# Altium schematic sheet 0152_HPB BATTERY CHARGE.SchDoc
size 848 x 558 mm
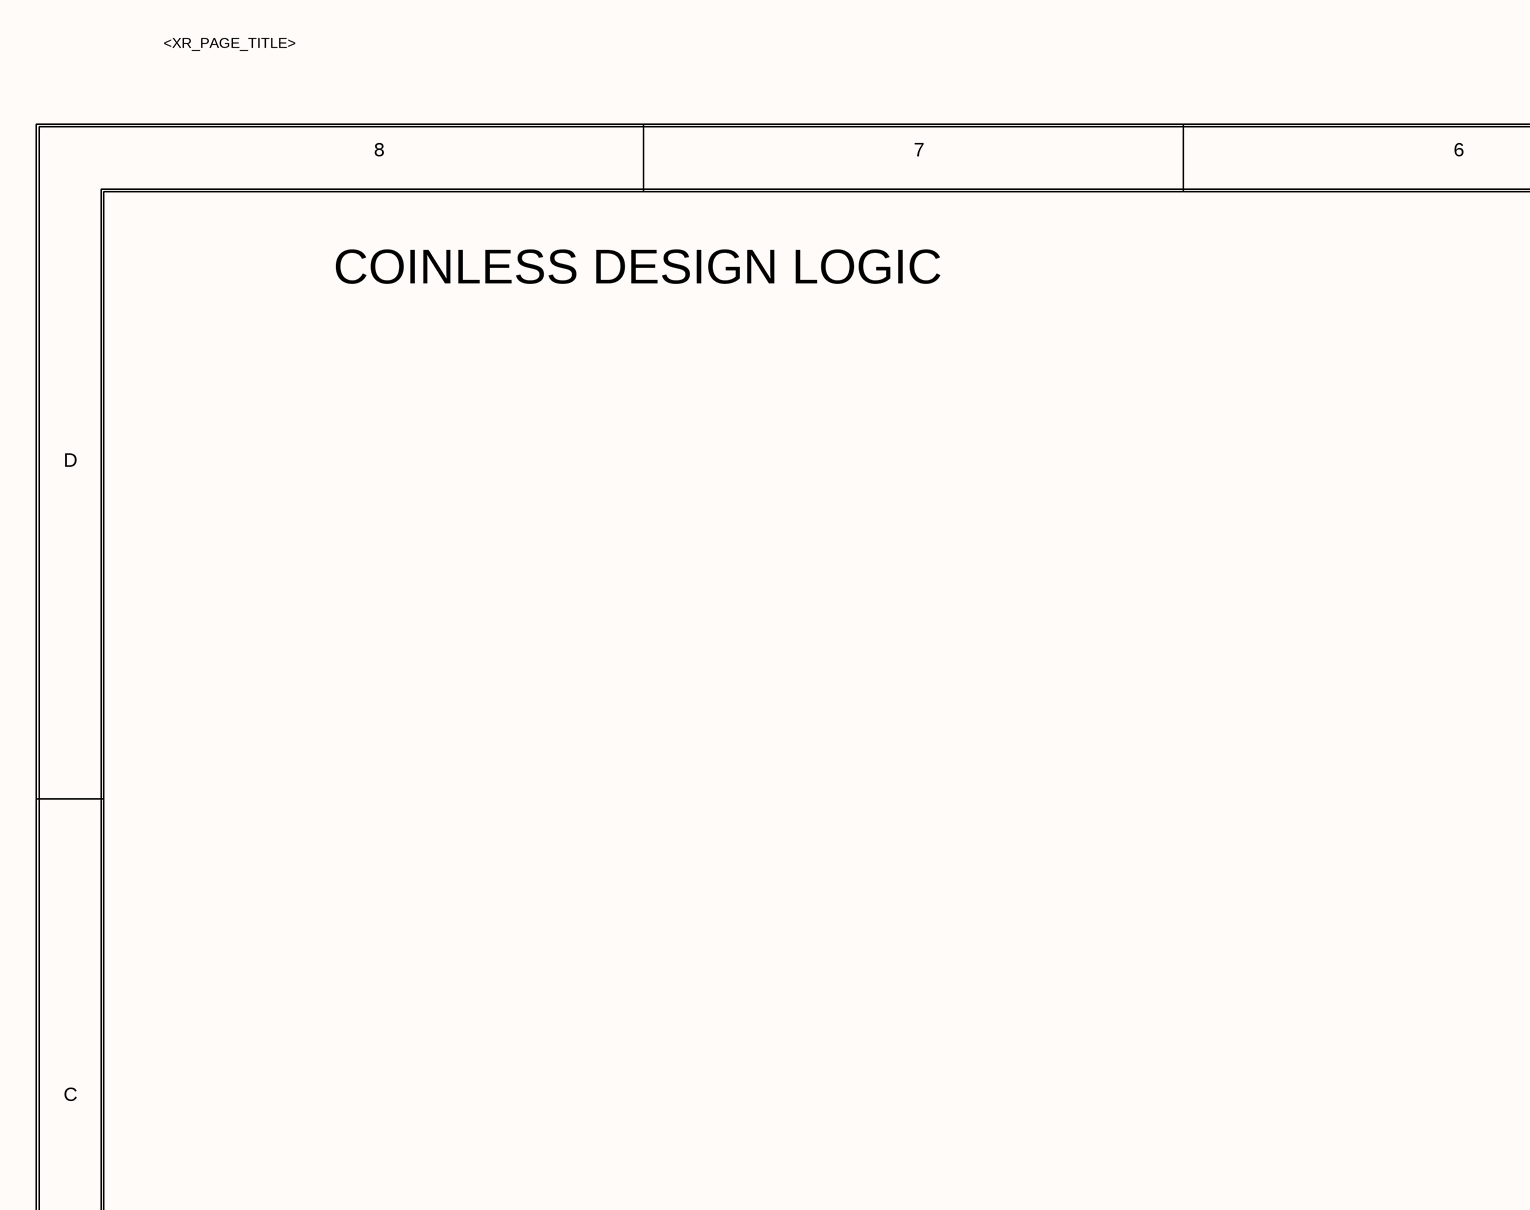
[diagram p0: 0152_HPB BATTERY CHARGE.SchDoc, top left]
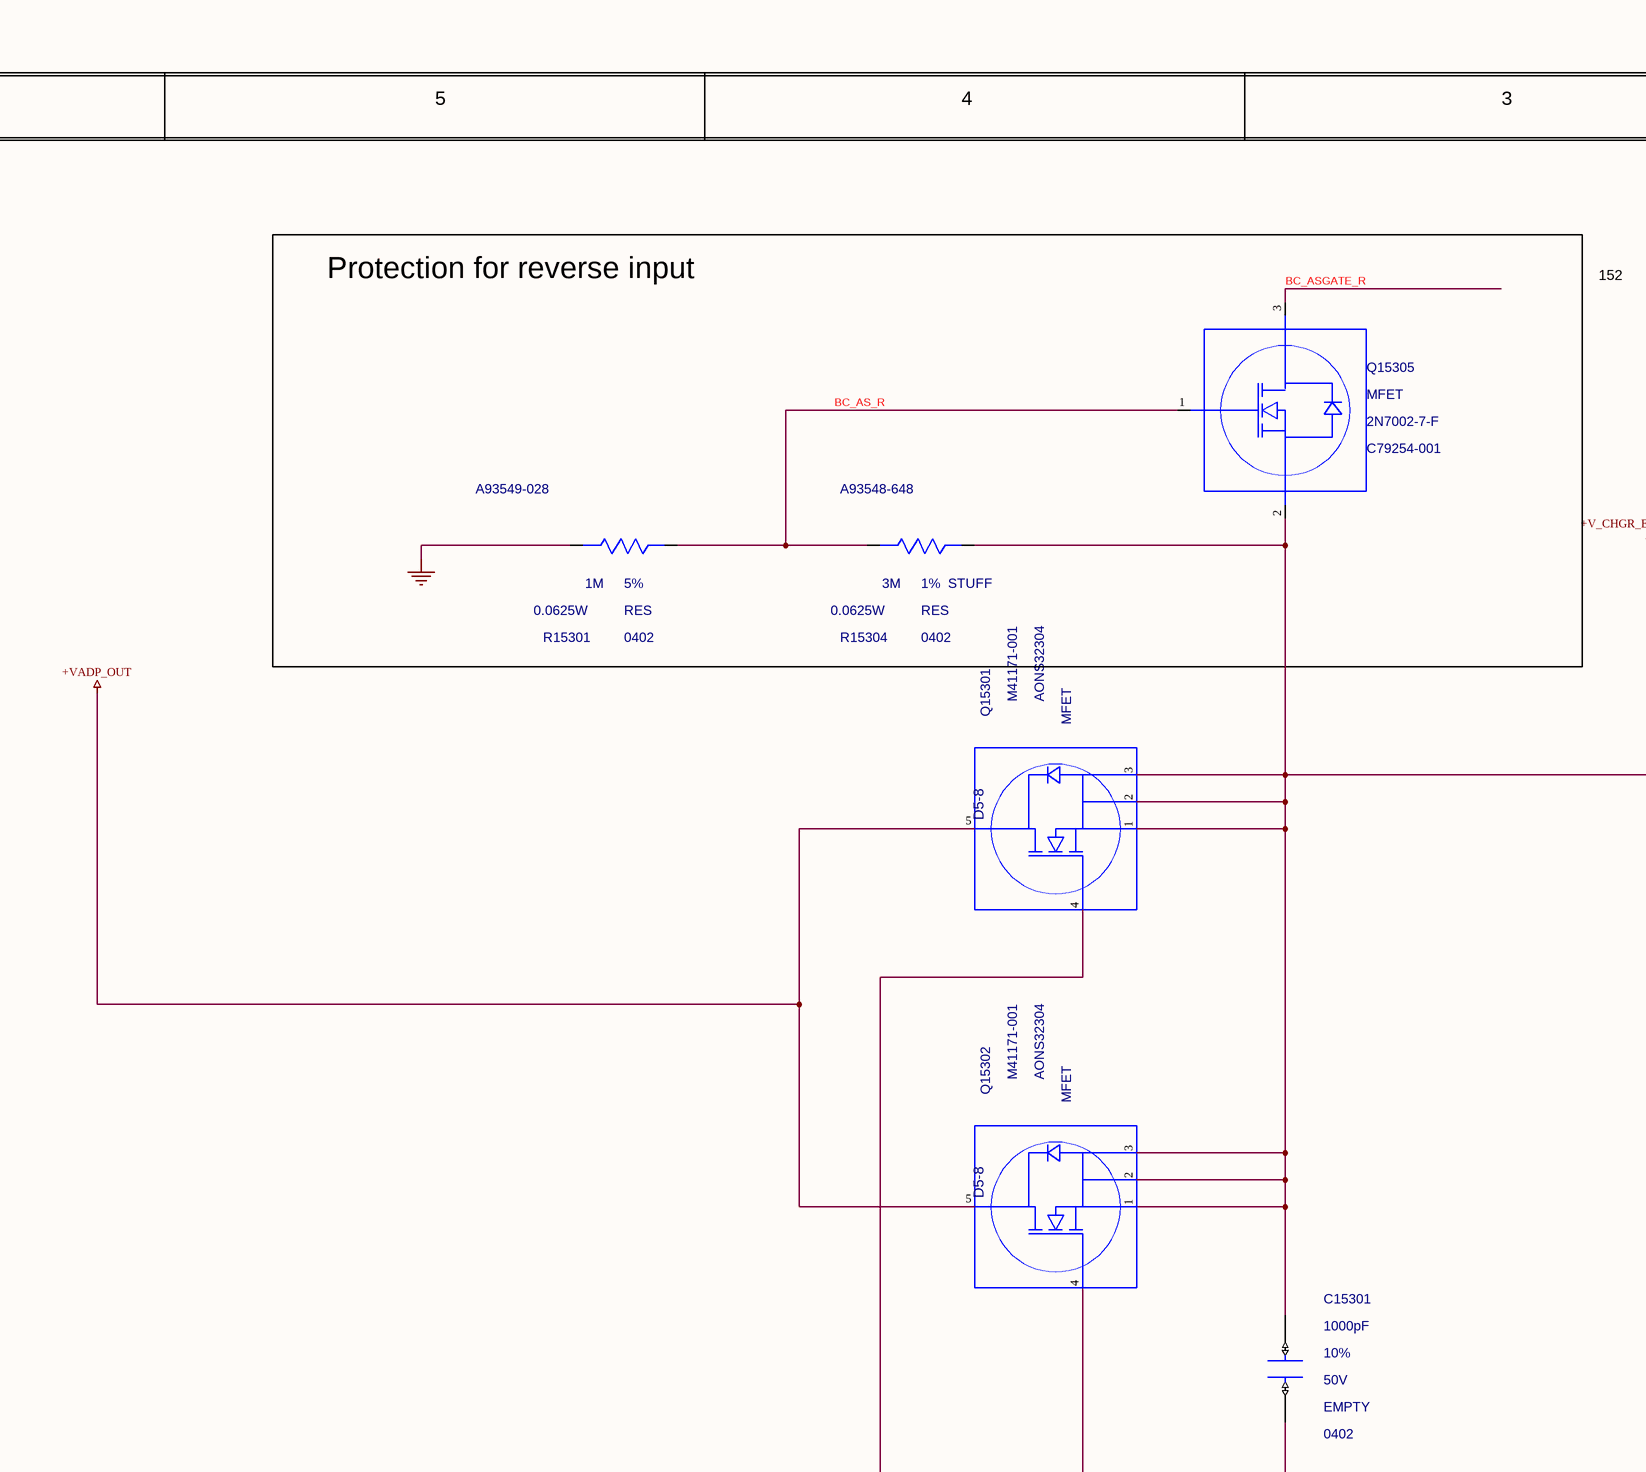
[diagram p1: 0152_HPB BATTERY CHARGE.SchDoc, top middle]
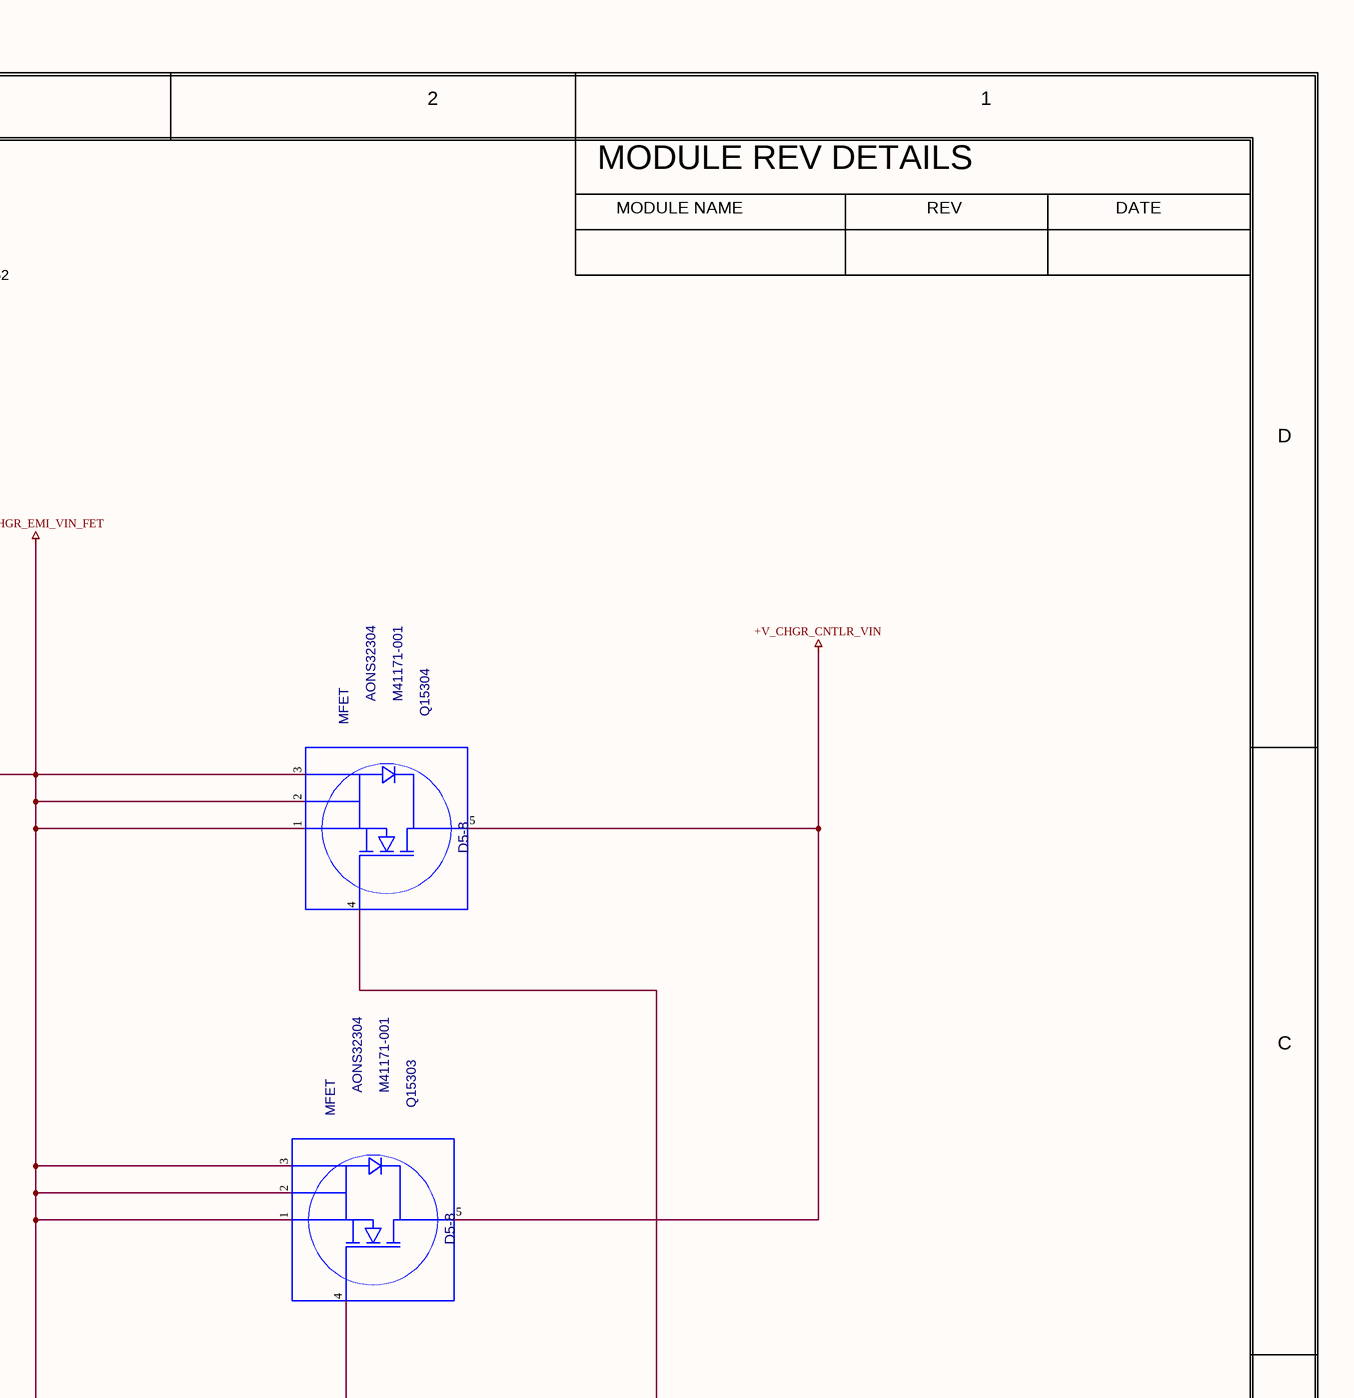
[diagram p2: 0152_HPB BATTERY CHARGE.SchDoc, top right]
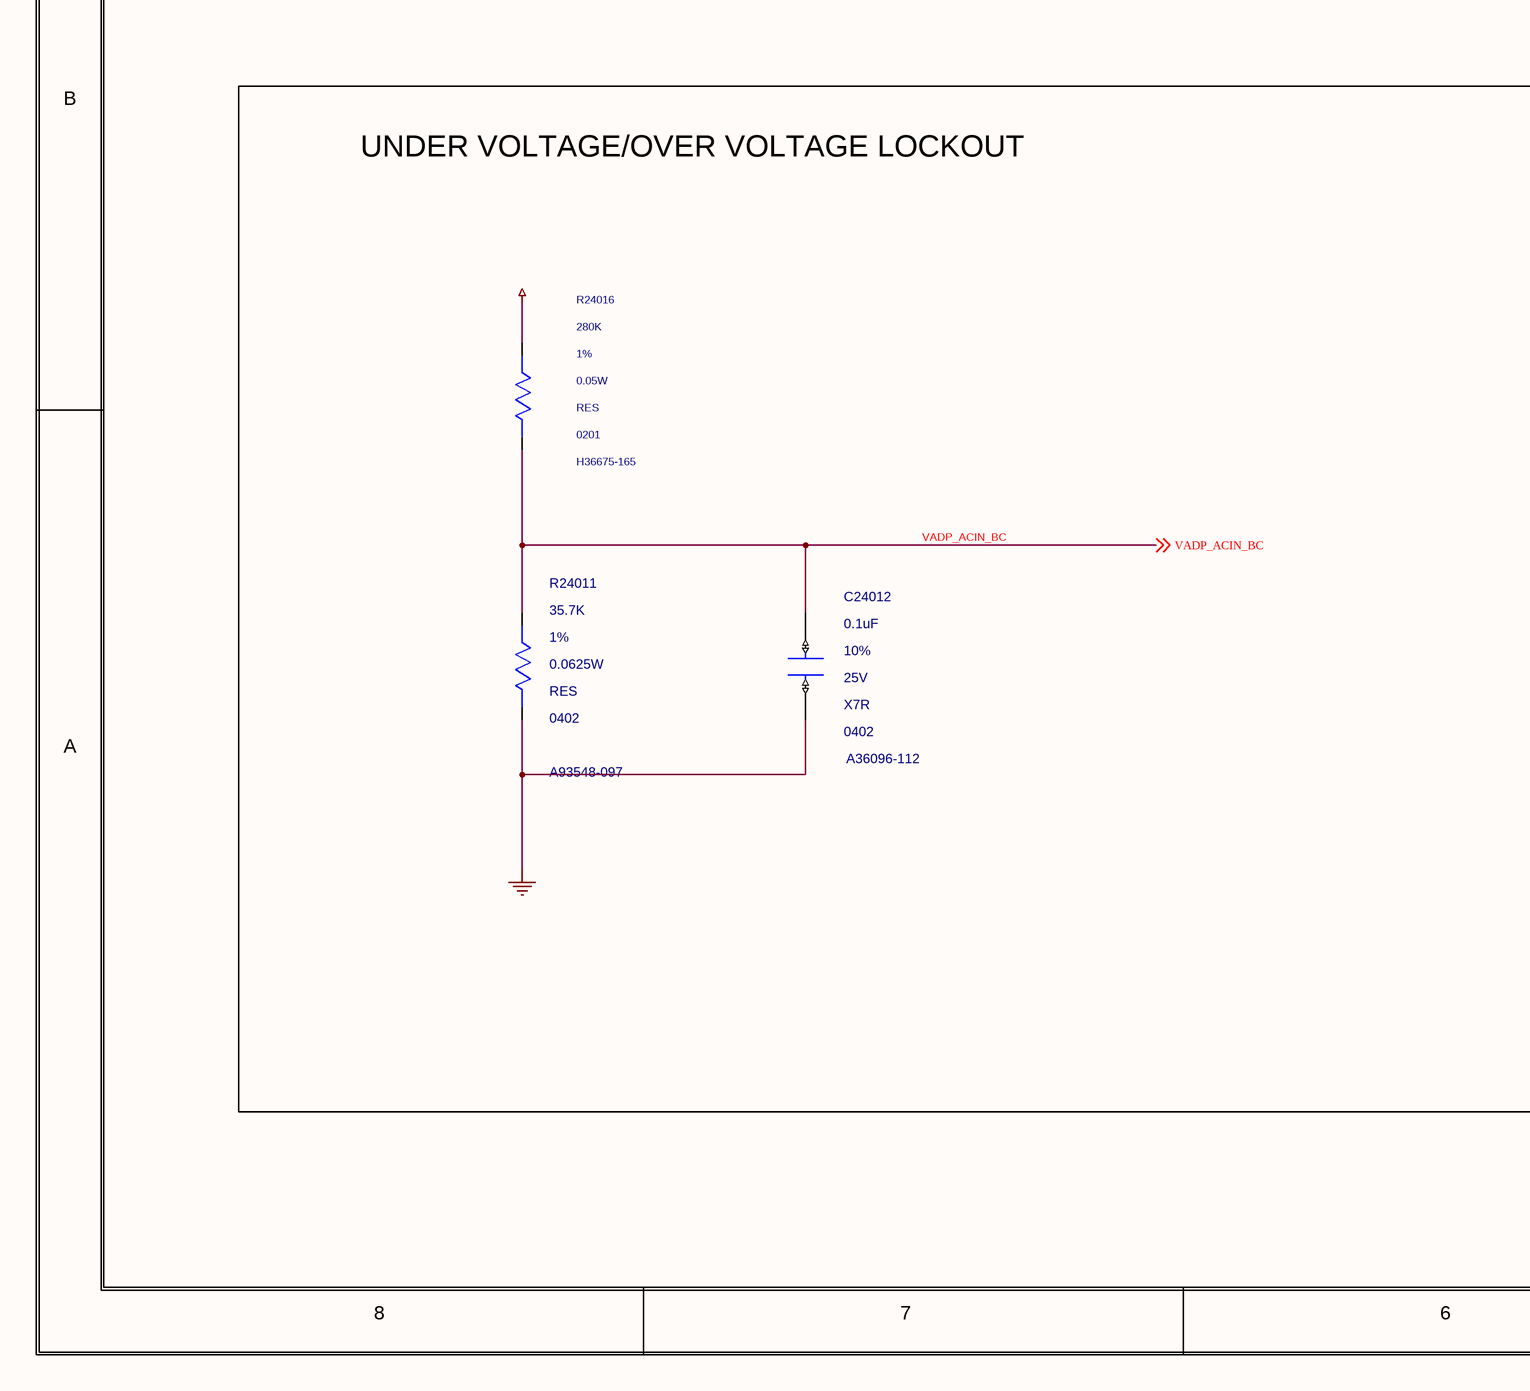
[diagram p3: 0152_HPB BATTERY CHARGE.SchDoc, bottom left]
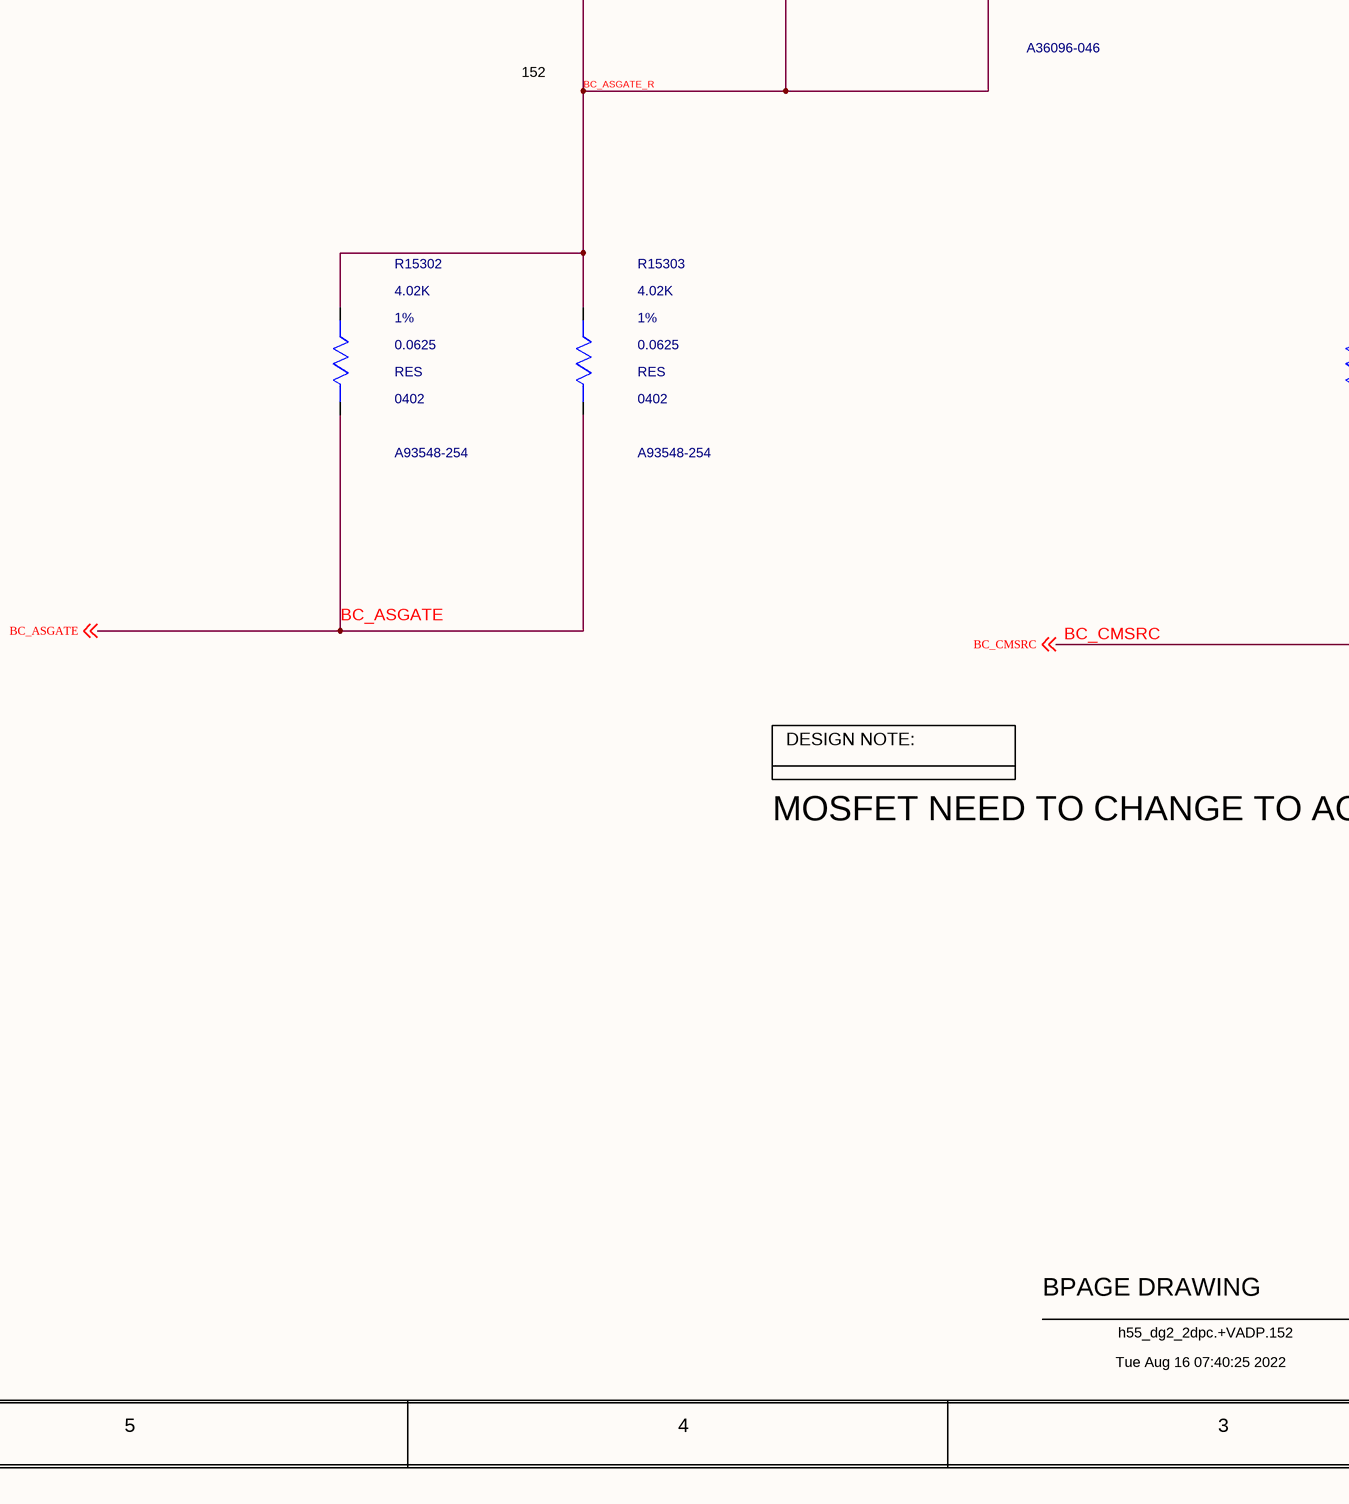
[diagram p4: 0152_HPB BATTERY CHARGE.SchDoc, bottom middle]
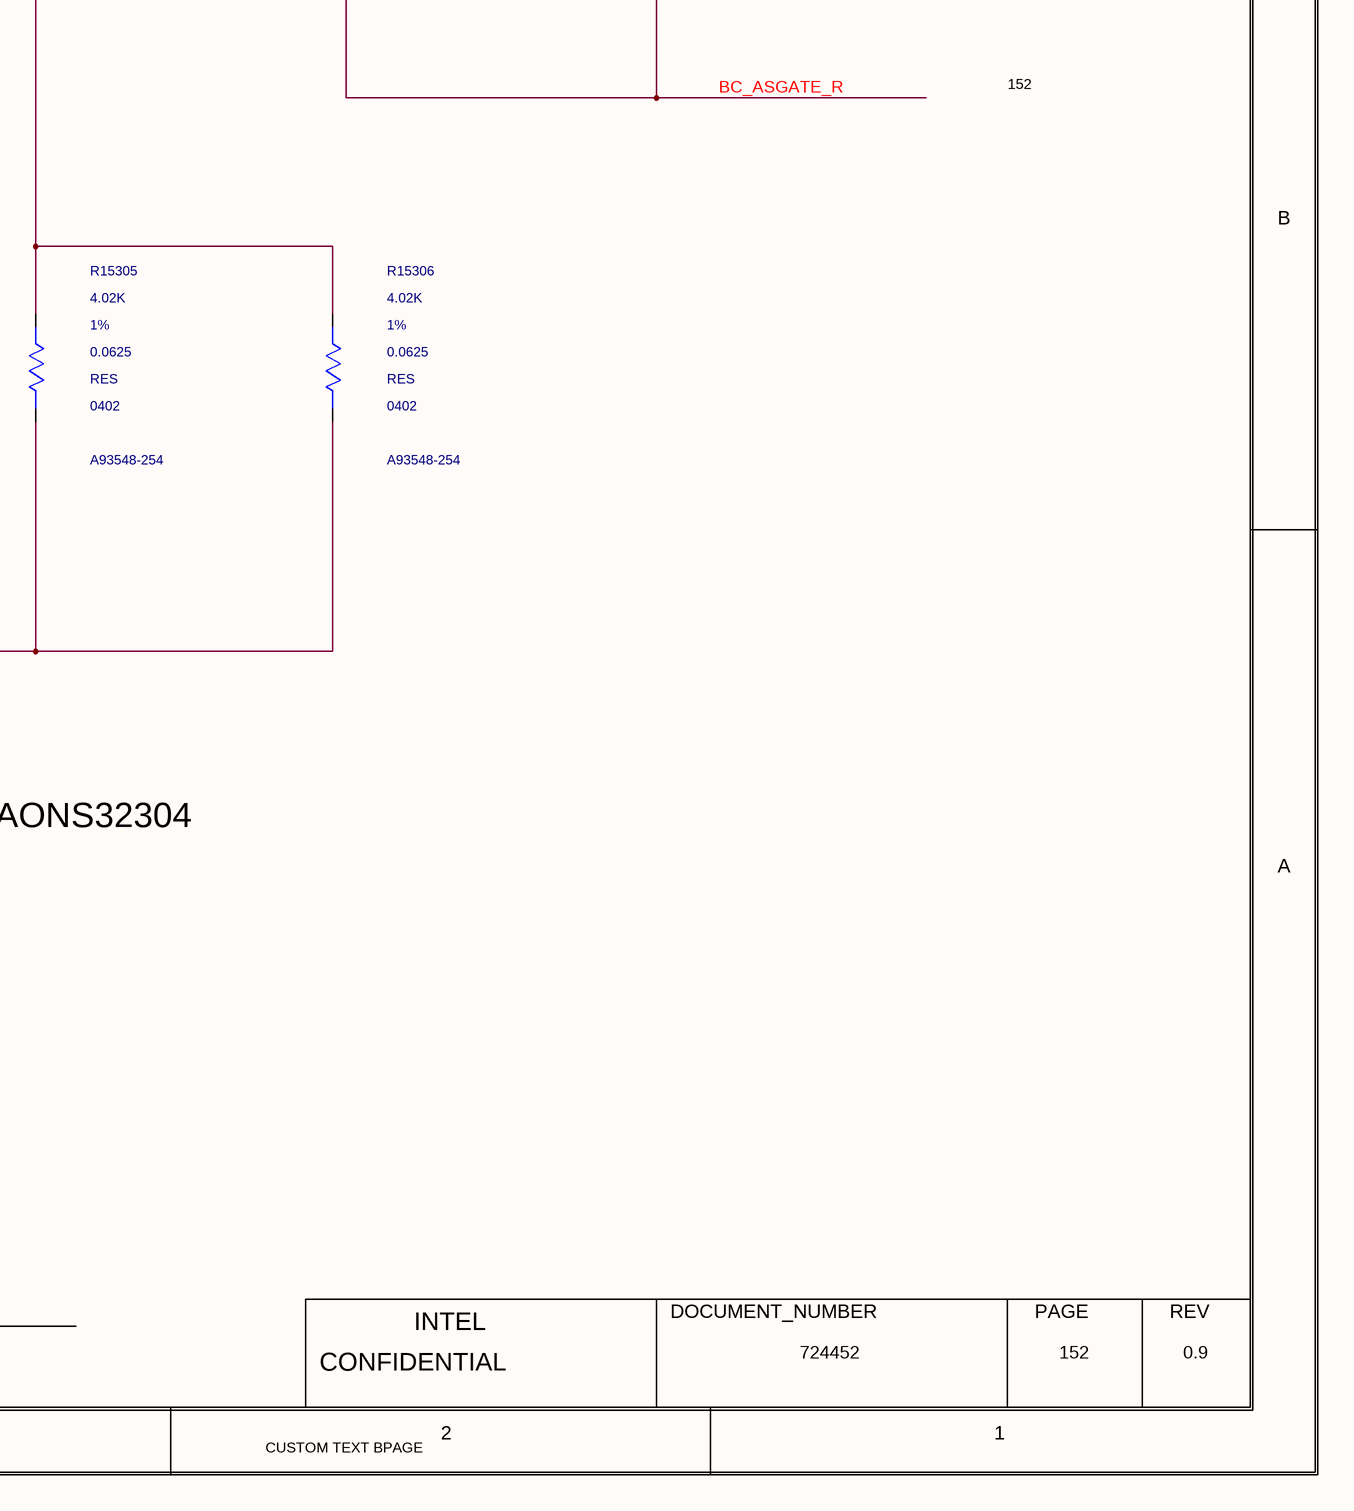
[diagram p5: 0152_HPB BATTERY CHARGE.SchDoc, bottom right]

## Parts
C15301  1000pF  MATERIAL: EMPTY  PACK_TYPE: 0402  PART_NUMBER: A36096-046  TOLERANCE: 10%  VOLTAGE: 50V  [CTK0_SM0402_1100X600_MA]
C24012  0.1uF  MATERIAL: X7R  PACK_TYPE: 0402  PART_NUMBER: A36096-112  TOLERANCE: 10%  VOLTAGE: 25V  [CTK2_SM0402_1050X550_MA]
Q15301  AONS32304  MATERIAL: MFET  PART_NUMBER: M41171-001  [CTK0_LCC8_5650X5300_1270_DF4670X4600_MA_VR]
Q15302  AONS32304  MATERIAL: MFET  PART_NUMBER: M41171-001  [CTK0_LCC8_5650X5300_1270_DF4670X4600_MA_VR]
Q15303  AONS32304  MATERIAL: MFET  PART_NUMBER: M41171-001  [CTK0_LCC8_5650X5300_1270_DF4670X4600_MA_VR]
Q15304  AONS32304  MATERIAL: MFET  PART_NUMBER: M41171-001  [CTK0_LCC8_5650X5300_1270_DF4670X4600_MA_VR]
Q15305  2N7002-7-F  MATERIAL: MFET  PART_NUMBER: C79254-001  [CTK0_SOT23_1400X3040_950_MG]
R15301  1M  MATERIAL: RES  PACK_TYPE: 0402  PART_NUMBER: A93549-028  TOLERANCE: 5%  WATTAGE: 0.0625W  [CTK0_SM0402_1100X550_MA]
R15302  4.02K  MATERIAL: RES  PACK_TYPE: 0402  PART_NUMBER: A93548-254  TOLERANCE: 1%  WATTAGE: 0.0625  [CTK0_SM0402_1100X550_MA]
R15303  4.02K  MATERIAL: RES  PACK_TYPE: 0402  PART_NUMBER: A93548-254  TOLERANCE: 1%  WATTAGE: 0.0625  [CTK0_SM0402_1100X550_MA]
R15304  3M  BOM_USE: STUFF  MATERIAL: RES  PACK_TYPE: 0402  PART_NUMBER: A93548-648  TOLERANCE: 1%  WATTAGE: 0.0625W  [TK0_SM0402_1100X550_MG]
R15305  4.02K  MATERIAL: RES  PACK_TYPE: 0402  PART_NUMBER: A93548-254  TOLERANCE: 1%  WATTAGE: 0.0625  [CTK0_SM0402_1100X550_MA]
R15306  4.02K  MATERIAL: RES  PACK_TYPE: 0402  PART_NUMBER: A93548-254  TOLERANCE: 1%  WATTAGE: 0.0625  [CTK0_SM0402_1100X550_MA]
R24011  35.7K  MATERIAL: RES  PACK_TYPE: 0402  PART_NUMBER: A93548-097  TOLERANCE: 1%  WATTAGE: 0.0625W  [CTK0_SM0402_1100X550_MA]
R24016  280K  MATERIAL: RES  PACK_TYPE: 0201  PART_NUMBER: H36675-165  TOLERANCE: 1%  WATTAGE: 0.05W  [CTK0_SM0201_630X330_MA]

## Blocks framed on the sheet
Protection for reverse input: Q15305 R15301 R15304
UNDER VOLTAGE/OVER VOLTAGE LOCKOUT: C24012 R24011 R24016

## Nets
+V_CHGR_CNTLR_VIN: Q15303.5(D) Q15304.5(D)
+V_CHGR_EMI_VIN_FET: C15301.1(A) Q15301.1(S1) Q15301.2(S2) Q15301.3(S3) Q15302.1(S1) Q15302.2(S2) Q15302.3(S3) Q15303.1(S1) Q15303.2(S2) Q15303.3(S3) Q15304.1(S1) Q15304.2(S2) Q15304.3(S3) Q15305.2(S) R15304.2(B) R15305.1(A) R15306.1(A)
+VADP_OUT: Q15301.5(D) Q15302.5(D) R24016.1(A)
GND: C24012.2(B) R15301.1(A) R24011.2(B)
BC_AS_R: Q15305.1(G) R15301.2(B) R15304.1(A)
BC_ASGATE: R15302.2(B) R15303.2(B) ; off-sheet BC_ASGATE
BC_ASGATE_R: C15301.2(B) Q15301.4(G) Q15302.4(G) Q15303.4(G) Q15304.4(G) Q15305.3(D) R15302.1(A) R15303.1(A)
BC_CMSRC: R15305.2(B) R15306.2(B) ; off-sheet BC_CMSRC
VADP_ACIN_BC: C24012.1(A) R24011.1(A) R24016.2(B) ; off-sheet VADP_ACIN_BC

## Notes on the sheet
- <XR_PAGE_TITLE>
- 8
- 7
- 6
- 5
- 4
- 3
- 2
- 1
- MODULE REV DETAILS
- COINLESS DESIGN LOGIC
- MODULE NAME
- REV
- DATE
- 152
- D
- C
- B
- DESIGN NOTE:
- MOSFET NEED TO CHANGE TO AONS32304
- A
- BPAGE DRAWING
- INTEL
- DOCUMENT_NUMBER
- PAGE
- Tue Aug 16 07:40:25 2022
- h55_dg2_2dpc.+VADP.152
- CONFIDENTIAL
- 724452
- 0.9
- CUSTOM TEXT BPAGE
- (in symbol C_MOSFET_N_4D3S1G) D5-8

## Library data of the parts
C15301 = C_CAP: CDS_PHYS_PART_NAME: C_CAP_0402-A36096-046,EMPTY,1000PF,50V,10%,TK0,GENERIC; CDS_LMAN_SYM_OUTLINE: -50,50,50,-50; FP_TECH: TK0; IP: GENERIC; ROOM: NONE; OriginalSymbolOrigin: (-50,25); XY: (-9700,2625); VER: 1; ROT: 0; PHYS_PAGE: 152; LOCATION: C15301; DRAWING: @RVP1_ADL_SB_ADP_S_DDR5_SODIMM_2DPC_LIB.H55_DG2_2DPC(SCH_1):PAGE521; CDS_LIB: c_discrete; VARIANT: ?; PCB Footprint: CTK0_SM0402_1100X600_MA; CHIPS_PART_NAME: C_CAP; CDS_PART_NAME: C_CAP_0402-A36096-046,EMPTY,1000PF,50V,10%,TK0,GENERIC; CDS_LOCATION: C15301
C24012 = C_CAP: CDS_PHYS_PART_NAME: C_CAP_0402-A36096-112,X7R,0.1UF,25V,10%,TK2,GENERIC; CDS_LMAN_SYM_OUTLINE: -50,50,50,-50; FP_TECH: TK2; IP: GENERIC; ROOM: NONE; OriginalSymbolOrigin: (-50,25); XY: (-13475,1050); VER: 1; ROT: 0; PHYS_PAGE: 152; LOCATION: C24012; DRAWING: @RVP1_ADL_SB_ADP_S_DDR5_SODIMM_2DPC_LIB.H55_DG2_2DPC(SCH_1):PAGE521; CDS_LIB: c_discrete; VARIANT: ?; PCB Footprint: CTK2_SM0402_1050X550_MA; CHIPS_PART_NAME: C_CAP; CDS_PART_NAME: C_CAP_0402-A36096-112,X7R,0.1UF,25V,10%,TK2,GENERIC; CDS_LOCATION: C24012
Q15301 = C_MOSFET_N_4D3S1G: CDS_PHYS_PART_NAME: C_MOSFET_N_4D3S1G_LCCA-M41171-001,MFET,AONS32304,TK0,GENERIC; CDS_LMAN_SYM_OUTLINE: -150,150,150,-150; FP_TECH: TK0; IP: GENERIC; PACK_TYPE: LCCA; ROOM: NONE; OriginalSymbolOrigin: (-150,150); XY: (-10125,3625); VER: 2; ROT: 1; PHYS_PAGE: 152; LOCATION: Q15301; DRAWING: @RVP1_ADL_SB_ADP_S_DDR5_SODIMM_2DPC_LIB.H55_DG2_2DPC(SCH_1):PAGE521; CDS_LIB: local; VARIANT: ?; PCB Footprint: CTK0_LCC8_5650X5300_1270_DF4670X4600_MA_VR; SEC_TYPE: LCCA; CHIPS_PART_NAME: C_MOSFET_N_4D3S1G; CDS_PART_NAME: C_MOSFET_N_4D3S1G_LCCA-M41171-001,MFET,AONS32304,TK0,GENERIC; CDS_LOCATION: Q15301
Q15302 = C_MOSFET_N_4D3S1G: CDS_PHYS_PART_NAME: C_MOSFET_N_4D3S1G_LCCA-M41171-001,MFET,AONS32304,TK0,GENERIC; CDS_LMAN_SYM_OUTLINE: -150,150,150,-150; FP_TECH: TK0; IP: GENERIC; PACK_TYPE: LCCA; ROOM: NONE; OriginalSymbolOrigin: (-150,150); XY: (-10125,2925); VER: 2; ROT: 1; PHYS_PAGE: 152; LOCATION: Q15302; DRAWING: @RVP1_ADL_SB_ADP_S_DDR5_SODIMM_2DPC_LIB.H55_DG2_2DPC(SCH_1):PAGE521; CDS_LIB: local; VARIANT: ?; PCB Footprint: CTK0_LCC8_5650X5300_1270_DF4670X4600_MA_VR; SEC_TYPE: LCCA; CHIPS_PART_NAME: C_MOSFET_N_4D3S1G; CDS_PART_NAME: C_MOSFET_N_4D3S1G_LCCA-M41171-001,MFET,AONS32304,TK0,GENERIC; CDS_LOCATION: Q15302
Q15303 = C_MOSFET_N_4D3S1G: CDS_PHYS_PART_NAME: C_MOSFET_N_4D3S1G_LCCA-M41171-001,MFET,AONS32304,TK0,GENERIC; CDS_LMAN_SYM_OUTLINE: -150,150,150,-150; FP_TECH: TK0; IP: GENERIC; PACK_TYPE: LCCA; ROOM: NONE; OriginalSymbolOrigin: (-150,150); XY: (-8400,2900); VER: 2; ROT: 7; PHYS_PAGE: 152; LOCATION: Q15303; DRAWING: @RVP1_ADL_SB_ADP_S_DDR5_SODIMM_2DPC_LIB.H55_DG2_2DPC(SCH_1):PAGE521; CDS_LIB: local; VARIANT: ?; PCB Footprint: CTK0_LCC8_5650X5300_1270_DF4670X4600_MA_VR; SEC_TYPE: LCCA; CHIPS_PART_NAME: C_MOSFET_N_4D3S1G; CDS_PART_NAME: C_MOSFET_N_4D3S1G_LCCA-M41171-001,MFET,AONS32304,TK0,GENERIC; CDS_LOCATION: Q15303
Q15304 = C_MOSFET_N_4D3S1G: CDS_PHYS_PART_NAME: C_MOSFET_N_4D3S1G_LCCA-M41171-001,MFET,AONS32304,TK0,GENERIC; CDS_LMAN_SYM_OUTLINE: -150,150,150,-150; FP_TECH: TK0; IP: GENERIC; PACK_TYPE: LCCA; ROOM: NONE; OriginalSymbolOrigin: (-150,150); XY: (-8375,3625); VER: 2; ROT: 7; PHYS_PAGE: 152; LOCATION: Q15304; DRAWING: @RVP1_ADL_SB_ADP_S_DDR5_SODIMM_2DPC_LIB.H55_DG2_2DPC(SCH_1):PAGE521; CDS_LIB: local; VARIANT: ?; PCB Footprint: CTK0_LCC8_5650X5300_1270_DF4670X4600_MA_VR; SEC_TYPE: LCCA; CHIPS_PART_NAME: C_MOSFET_N_4D3S1G; CDS_PART_NAME: C_MOSFET_N_4D3S1G_LCCA-M41171-001,MFET,AONS32304,TK0,GENERIC; CDS_LOCATION: Q15304
Q15305 = C_MOSFET_N#1: CDS_PHYS_PART_NAME: C_MOSFET_N_SOT23-C79254-001,MFET,2N7002-7-F,TK0,GENERIC; CDS_LMAN_SYM_OUTLINE: -150,150,150,-150; FP_TECH: TK0; IP: GENERIC; PACK_TYPE: SOT23; ROOM: NONE; OriginalSymbolOrigin: (-175,175); XY: (-9700,4400); VER: 1; ROT: 0; PHYS_PAGE: 152; LOCATION: Q15305; DRAWING: @RVP1_ADL_SB_ADP_S_DDR5_SODIMM_2DPC_LIB.H55_DG2_2DPC(SCH_1):PAGE521; CDS_LIB: local; VARIANT: ?; PCB Footprint: CTK0_SOT23_1400X3040_950_MG; CHIPS_PART_NAME: C_MOSFET_N; CDS_PART_NAME: C_MOSFET_N_SOT23-C79254-001,MFET,2N7002-7-F,TK0,GENERIC; CDS_LOCATION: Q15305
R15301 = C_RES#1: CHIPS_PART_NAME: C_RES; CDS_PHYS_PART_NAME: C_RES_0402-A93549-028,RES,1M,5%,0.0625W,TK0,GENERIC; CDS_LMAN_SYM_OUTLINE: -50,50,50,-50; FP_TECH: TK0; IP: GENERIC; ROOM: NONE; OriginalSymbolOrigin: (-75,25); XY: (-10925,4150); VER: 1; ROT: 0; PHYS_PAGE: 152; LOCATION: R15301; DRAWING: @RVP1_ADL_SB_ADP_S_DDR5_SODIMM_2DPC_LIB.H55_DG2_2DPC(SCH_1):PAGE521; CDS_LIB: c_discrete; VARIANT: ?; PCB Footprint: CTK0_SM0402_1100X550_MA; CDS_PART_NAME: C_RES_0402-A93549-028,RES,1M,5%,0.0625W,TK0,GENERIC; CDS_LOCATION: R15301
R15302 = C_RES: CDS_PHYS_PART_NAME: C_RES_0402-A93548-254,RES,4.02K,1%,0.0625,TK0,GENERIC; CDS_LMAN_SYM_OUTLINE: -50,50,50,-50; FP_TECH: TK0; IP: GENERIC; ROOM: NONE; OriginalSymbolOrigin: (-25,75); XY: (-10900,1825); VER: 2; ROT: 0; PHYS_PAGE: 152; LOCATION: R15302; DRAWING: @RVP1_ADL_SB_ADP_S_DDR5_SODIMM_2DPC_LIB.H55_DG2_2DPC(SCH_1):PAGE521; CDS_LIB: c_discrete; VARIANT: ?; PCB Footprint: CTK0_SM0402_1100X550_MA; CHIPS_PART_NAME: C_RES; CDS_PART_NAME: C_RES_0402-A93548-254,RES,4.02K,1%,0.0625,TK0,GENERIC; CDS_LOCATION: R15302
R15303 = C_RES: CDS_PHYS_PART_NAME: C_RES_0402-A93548-254,RES,4.02K,1%,0.0625,TK0,GENERIC; CDS_LMAN_SYM_OUTLINE: -50,50,50,-50; FP_TECH: TK0; IP: GENERIC; ROOM: NONE; OriginalSymbolOrigin: (-25,75); XY: (-10450,1825); VER: 2; ROT: 0; PHYS_PAGE: 152; LOCATION: R15303; DRAWING: @RVP1_ADL_SB_ADP_S_DDR5_SODIMM_2DPC_LIB.H55_DG2_2DPC(SCH_1):PAGE521; CDS_LIB: c_discrete; VARIANT: ?; PCB Footprint: CTK0_SM0402_1100X550_MA; CHIPS_PART_NAME: C_RES; CDS_PART_NAME: C_RES_0402-A93548-254,RES,4.02K,1%,0.0625,TK0,GENERIC; CDS_LOCATION: R15303
R15304 = RES_2#1: CHIPS_PART_NAME: RES_2; CDS_PHYS_PART_NAME: RES_2_0402-A93548-648,RES,3M,1%,0.0625W,TK0,GENERIC; CDS_LMAN_SYM_OUTLINE: -50,50,50,-50; FP_TECH: TK0; IP: GENERIC; ROOM: NONE; OriginalSymbolOrigin: (-75,25); XY: (-10375,4150); VER: 1; ROT: 0; PHYS_PAGE: 152; LOCATION: R15304; DRAWING: @RVP1_ADL_SB_ADP_S_DDR5_SODIMM_2DPC_LIB.H55_DG2_2DPC(SCH_1):PAGE521; CDS_LIB: discrete_2; VARIANT: ?; PCB Footprint: TK0_SM0402_1100X550_MG; CDS_PART_NAME: RES_2_0402-A93548-648,RES,3M,1%,0.0625W,TK0,GENERIC; CDS_LOCATION: R15304
R15305 = C_RES: CDS_PHYS_PART_NAME: C_RES_0402-A93548-254,RES,4.02K,1%,0.0625,TK0,GENERIC; CDS_LMAN_SYM_OUTLINE: -50,50,50,-50; FP_TECH: TK0; IP: GENERIC; ROOM: NONE; OriginalSymbolOrigin: (-25,75); XY: (-9025,1825); VER: 2; ROT: 0; PHYS_PAGE: 152; LOCATION: R15305; DRAWING: @RVP1_ADL_SB_ADP_S_DDR5_SODIMM_2DPC_LIB.H55_DG2_2DPC(SCH_1):PAGE521; CDS_LIB: c_discrete; VARIANT: ?; PCB Footprint: CTK0_SM0402_1100X550_MA; CHIPS_PART_NAME: C_RES; CDS_PART_NAME: C_RES_0402-A93548-254,RES,4.02K,1%,0.0625,TK0,GENERIC; CDS_LOCATION: R15305
R15306 = C_RES: CDS_PHYS_PART_NAME: C_RES_0402-A93548-254,RES,4.02K,1%,0.0625,TK0,GENERIC; CDS_LMAN_SYM_OUTLINE: -50,50,50,-50; FP_TECH: TK0; IP: GENERIC; ROOM: NONE; OriginalSymbolOrigin: (-25,75); XY: (-8475,1825); VER: 2; ROT: 0; PHYS_PAGE: 152; LOCATION: R15306; DRAWING: @RVP1_ADL_SB_ADP_S_DDR5_SODIMM_2DPC_LIB.H55_DG2_2DPC(SCH_1):PAGE521; CDS_LIB: c_discrete; VARIANT: ?; PCB Footprint: CTK0_SM0402_1100X550_MA; CHIPS_PART_NAME: C_RES; CDS_PART_NAME: C_RES_0402-A93548-254,RES,4.02K,1%,0.0625,TK0,GENERIC; CDS_LOCATION: R15306
R24011 = C_RES: CDS_PHYS_PART_NAME: C_RES_0402-A93548-097,RES,35.7K,1%,0.0625W,TK0,GENERIC; CDS_LMAN_SYM_OUTLINE: -50,50,50,-50; FP_TECH: TK0; IP: GENERIC; ROOM: NONE; OriginalSymbolOrigin: (-25,75); XY: (-14000,1050); VER: 2; ROT: 0; PHYS_PAGE: 152; LOCATION: R24011; DRAWING: @RVP1_ADL_SB_ADP_S_DDR5_SODIMM_2DPC_LIB.H55_DG2_2DPC(SCH_1):PAGE521; CDS_LIB: c_discrete; VARIANT: ?; PCB Footprint: CTK0_SM0402_1100X550_MA; CHIPS_PART_NAME: C_RES; CDS_PART_NAME: C_RES_0402-A93548-097,RES,35.7K,1%,0.0625W,TK0,GENERIC; CDS_LOCATION: R24011
R24016 = C_RES: CDS_PHYS_PART_NAME: C_RES_0201-H36675-165,RES,280K,1%,0.05W,TK0,GENERIC; CDS_LMAN_SYM_OUTLINE: -50,50,50,-50; FP_TECH: TK0; IP: GENERIC; ROOM: NONE; OriginalSymbolOrigin: (-25,75); XY: (-14000,1550); VER: 2; ROT: 0; PHYS_PAGE: 152; LOCATION: R24016; DRAWING: @RVP1_ADL_SB_ADP_S_DDR5_SODIMM_2DPC_LIB.H55_DG2_2DPC(SCH_1):PAGE521; CDS_LIB: c_discrete; VARIANT: ?; PCB Footprint: CTK0_SM0201_630X330_MA; SEC_TYPE: 0201; CHIPS_PART_NAME: C_RES; CDS_PART_NAME: C_RES_0201-H36675-165,RES,280K,1%,0.05W,TK0,GENERIC; CDS_LOCATION: R24016